# EAGLE design BenWalters_BB (EAGLE 9.0.1)
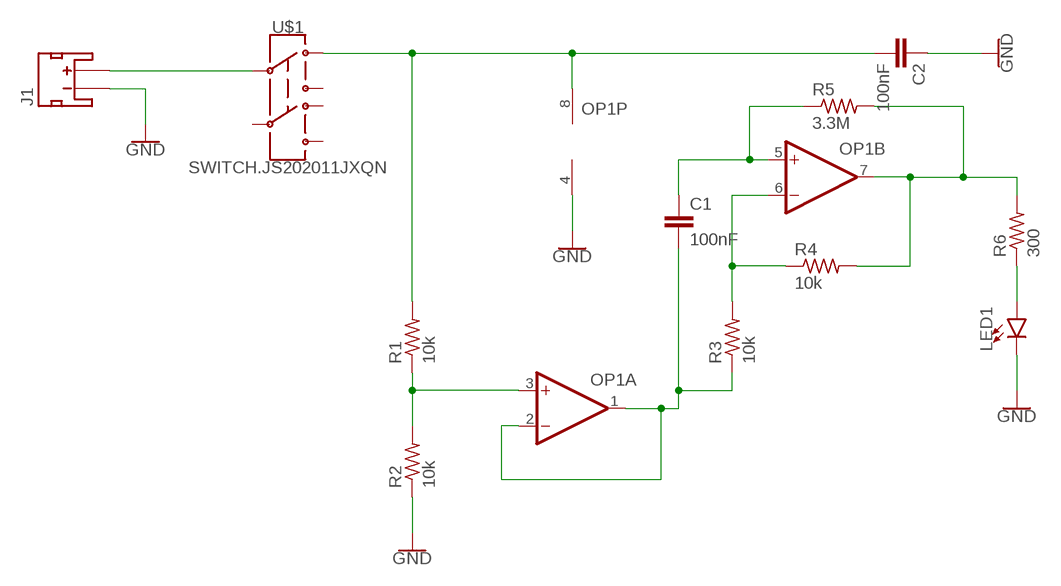
[diagram p0: schematic, sheet 1]

## Parts
C1  100nF  CAPACITOR0805  [C0805]
C2  100nF  CAPACITOR0805  [C0805]
J1  3.7V  JST_2MM_MALE  [JST-2-SMD]
LED1  LED3MM  [LED_3MM]
OP1  OP-DUALRM  [MSOP08]
R1  10k  RESISTOR0805  [R0805]
R2  10k  RESISTOR0805  [R0805]
R3  10k  RESISTOR0805  [R0805]
R4  10k  RESISTOR0805  [R0805]
R5  3.3M  RESISTOR0805  [R0805]
R6  300  RESISTOR0805  [R0805]
U$1  SWITCH.JS202011JXQN  [SWITCH.00.THT]

## Nets
GND: C2.1 J1.1(-) LED1.K(C) OP1.4(P:V-) R2.1
N$1: J1.2(+) U$1.2
N$2: C2.2 OP1.8(P:V+) R1.2 U$1.1
N$3: OP1.3(A:+IN) R1.1 R2.2
N$4: C1.2 OP1.1(A:OUT) OP1.2(A:-IN) R3.1
N$5: OP1.6(B:-IN) R3.2 R4.1
N$6: C1.1 OP1.5(B:+IN) R5.1
N$7: OP1.7(B:OUT) R4.2 R5.2 R6.2
N$8: LED1.A R6.1
Unconnected: J1.NC1(PAD1) J1.NC2(PAD2) U$1.3 U$1.5 U$1.6 U$1.7

## Library data of the parts
C1 C2 = CalvEngIO-Passives:CAPACITOR
J1 = CalvEngIO-Connectors:JST_2MM_MALE: JST 2MM MALE RA CONNECTOR Two pin, compact surface mount connector. Commonly used as a battery input connection point. We really like the solid locking feeling and high current rating on these small connectors. We use these all the time as battery connectors. Mates to single-cell LiPo batteries. Here is the connector we sell at SparkFun: JST Right Angle Connector - White <https://www.sparkfun.com/products/8612> (PRT-08612) Datasheet <http://www.sparkfun.com/datasheets/Prototyping/Connectors/JST-Horizontal.pdf> It was used on these SparkFun products: SparkFun MOSFET Power Controller <https://www.sparkfun.com/products/11214> (PRT-11214) SparkFun Battery Babysitter - LiPo Battery Manager <https://www.sparkfun.com/products/13777> (PRT-13777) And many, many others that required a lipo battery connection.; PROD_ID: CONN-11443; SF_ID: PRT-08612
LED1 = CalvEngIO-LED:LED: LED (Generic) Standard schematic elements and footprints for 5mm, 3mm, 1206, and 0603 sized LEDs. Generic LEDs with no color specified. LTST-C190KGKT: arrow indicates cathode; PROD_ID: DIO-08794
OP1 = CalvEngIO-AnalogIC:OP-DUAL: Precision Micropower, Low Noise CMOS, Rail-to-Rail Input/Output Operational Amplifiers Source: http://www.analog.com/static/imported-files/data_sheets/AD8603_8607_8609.pdf; MF: ALTERA CORPORATION; MPN: AD8607ARMZ-REEL; OC_FARNELL: 1464990; OC_NEWARK: 59K6925
R1-R6 = CalvEngIO-Passives:RESISTOR
U$1 = CalvEngIO-Switches:SWITCH.JS202011JXQN: Manufacturer's Part Numer: JS202011JAQN for right angle throw JS202011JCQN for top side throw

## Net classes
0 default: clearance 0.205 mm

## Board
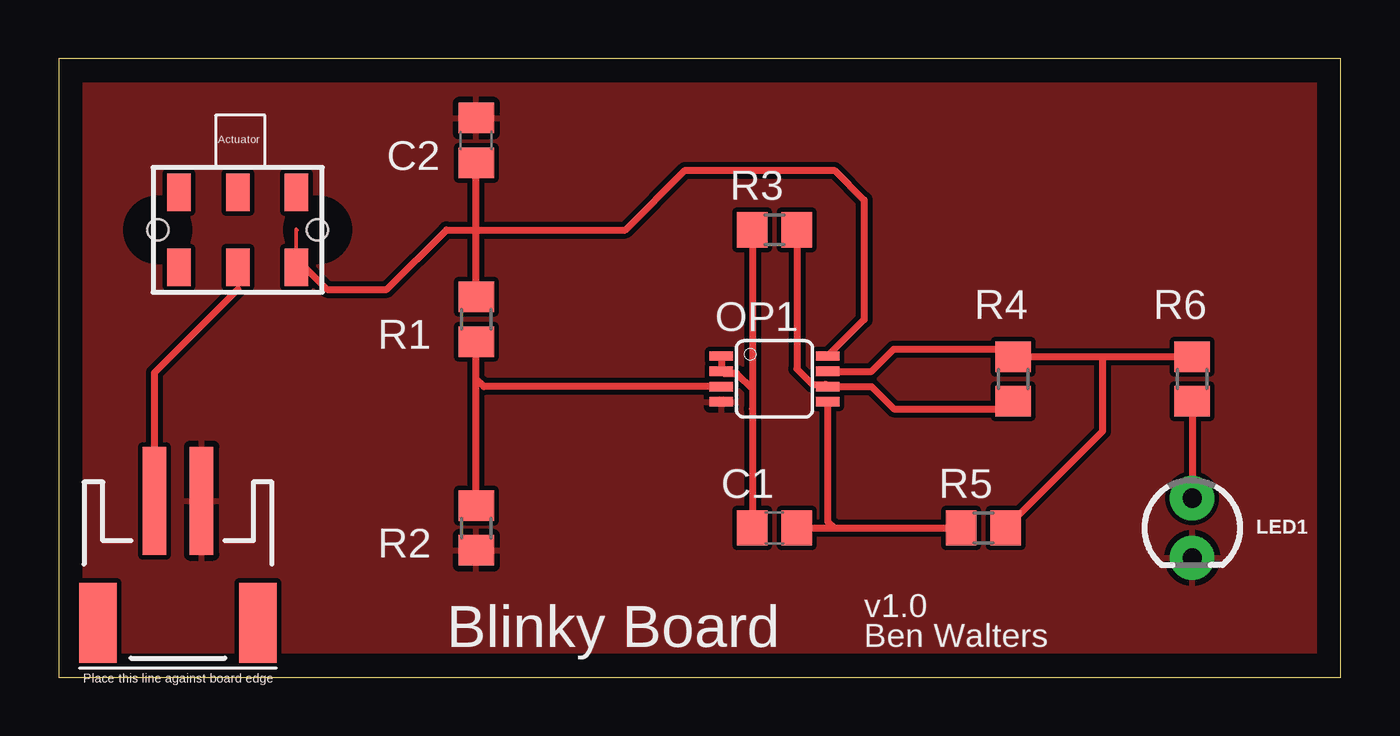
[diagram p1: board, top side]
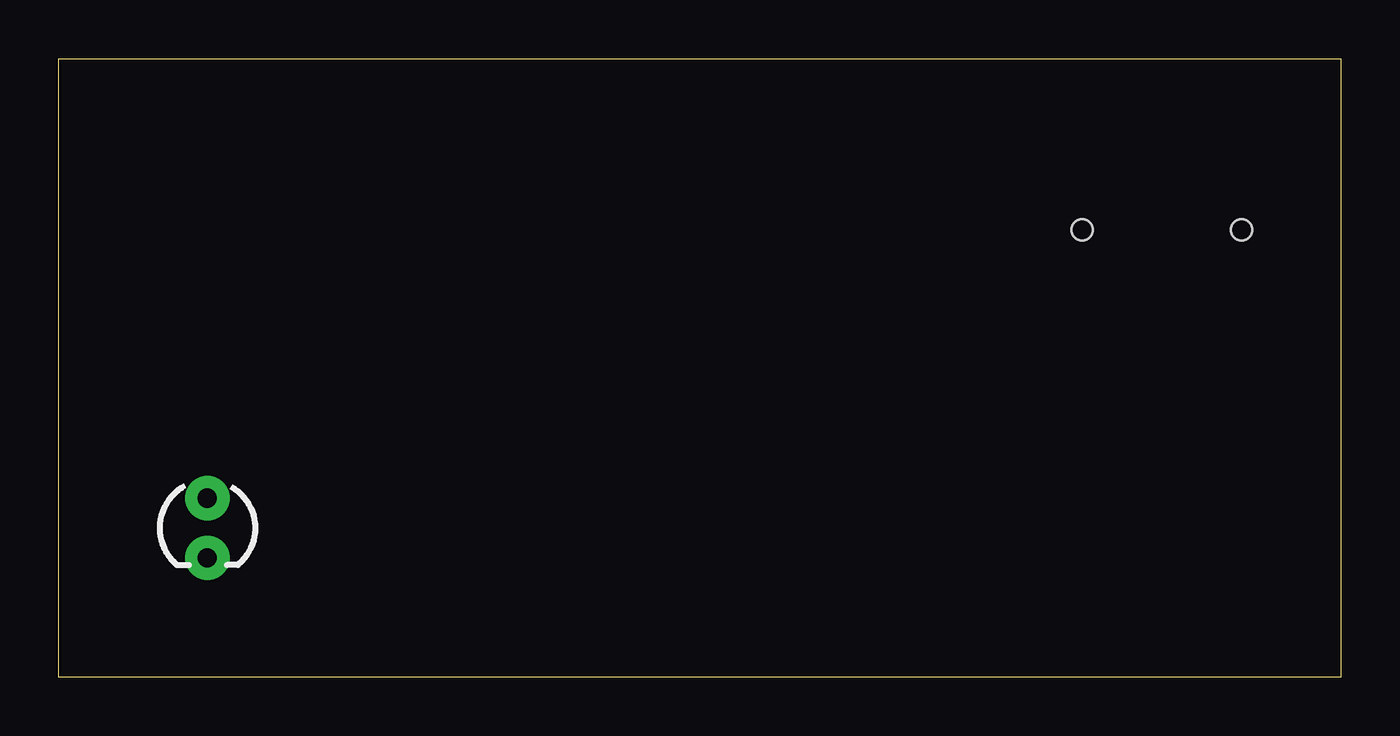
[diagram p2: board, bottom side, seen from below]

Size 54.59 x 26.34 mm. Coordinates in mm from the lower left corner, seen from the top.
Outline: 0,0 54.59,0 54.59,26.34 0,26.34 0,0
Copper layers (1*16): Top 0.035mm / dielectric 1.5mm / Bottom 0.035mm
Design rules "default": minimum track width 6mil, minimum drill 0.35mm, track to track 6mil, track to pad 6mil, pad to pad 6mil, via to via 6mil, smd to smd 6mil, copper to edge 40mil, drill to drill 6mil, minimum pad ring 10mil, minimum via ring 8mil, stop-mask expansion 4mil, vias tented up to drill 0mil, thermal gap 10mil

### Footprints (pad centres in the part's own frame; a part is rotated, then mirrored left to right if it is on the bottom)
C0805 = smd 1.3 x 1.5: 1 -0.95,0; 2 0.95,0
JST-2-SMD = smd 1 x 4.6: 1 -1,-3.7; 2 1,-3.7 | smd 1.6 x 3.4: NC1 -3.4,1.5; NC2 3.4,1.5
LED_3MM = drill 0.813 pad 1.88: A -1.27,0; K 1.27,0
MSOP08 = smd 0.4 x 1: 1 -0.976,-2.263; 2 -0.326,-2.263; 3 0.324,-2.263; 4 0.974,-2.263; 5 0.974,2.262; 6 0.324,2.262; 7 -0.326,2.262; 8 -0.976,2.262
R0805 = smd 1.3 x 1.5: 1 -0.95,0; 2 0.95,0
SWITCH.00.THT = smd 1 x 1.6: 1 -2.5,1.6; 2 0,1.6; 3 2.5,1.6; 5 -2.5,-1.6; 6 0,-1.6; 7 2.5,-1.6 | hole 0.9: -3.4,0; 3.4,0

### Placement (x,y rotation side)
C1  30.48,6.35 180 top
C2  17.78,22.86 270 top
J1  5.08,3.81 180 top
LED1  48.26,6.35 270 top
OP1  30.48,12.7 270 top
R1  17.78,15.24 90 top
R2  17.78,6.35 90 top
R3  30.48,19.05 0 top
R4  40.64,12.7 90 top
R5  39.37,6.35 0 top
R6  48.26,12.7 90 top
U$1  7.62,19.05 180 top

### Tracks (layer width: path | path; a pad name or v marks a point on that pad's centre or on a via)
GND
  pour Top: -1.27,27.94 -1.27,-1.27 55.88,-1.27 55.88,27.94
N$1
  Top 0.152: 7.62,16.51 U$1.2
  Top 0.305: J1.2 4.08,12.97 7.62,16.51
N$2
  Top 0.152: U$1.1 10.12,19.09 10.16,19.05
  Top 0.305: R1.2 17.78,19.05 | 17.78,19.05 C2.2 | U$1.1 10.33,17.45 10.35,17.43 10.51,17.43 11.43,16.51 13.97,16.51 16.51,19.05 17.78,19.05 | 17.78,19.05 24.13,19.05 26.67,21.59 33.02,21.59 34.29,20.32 34.29,15.22 OP1.8
N$3
  Top 0.305: R2.2 17.78,12.7 | 17.78,12.7 R1.1 | OP1.3 18.1,12.38 17.78,12.7
N$4
  Top 0.152: 28.88,13.03 OP1.2
  Top 0.305: OP1.1 OP1.2 28.31,12.93 28.86,12.93 29.53,12.27 | 29.53,12.27 29.53,11.43 C1.2 | R3.1 29.53,12.27
N$5
  Top 0.305: R3.2 31.43,13.13 32.09,12.47 32.65,12.47 OP1.6 34.61,12.38 35.56,11.43 40.32,11.43 R4.1
N$6
  Top 0.305: C1.1 33.02,6.35 | 33.02,6.35 R5.1 | OP1.5 32.74,6.63 33.02,6.35
N$7
  Top 0.305: OP1.7 34.62,13.03 35.56,13.97 40.32,13.97 R4.2 44.45,13.65 | 44.45,13.65 R6.2 | R5.2 44.45,10.48 44.45,13.65
N$8
  Top 0.305: R6.1 LED1.A

### Text on the board
tNames: v1.0 | Blinky Board | Ben Walters